# Altium project RadioDev.prjpcb
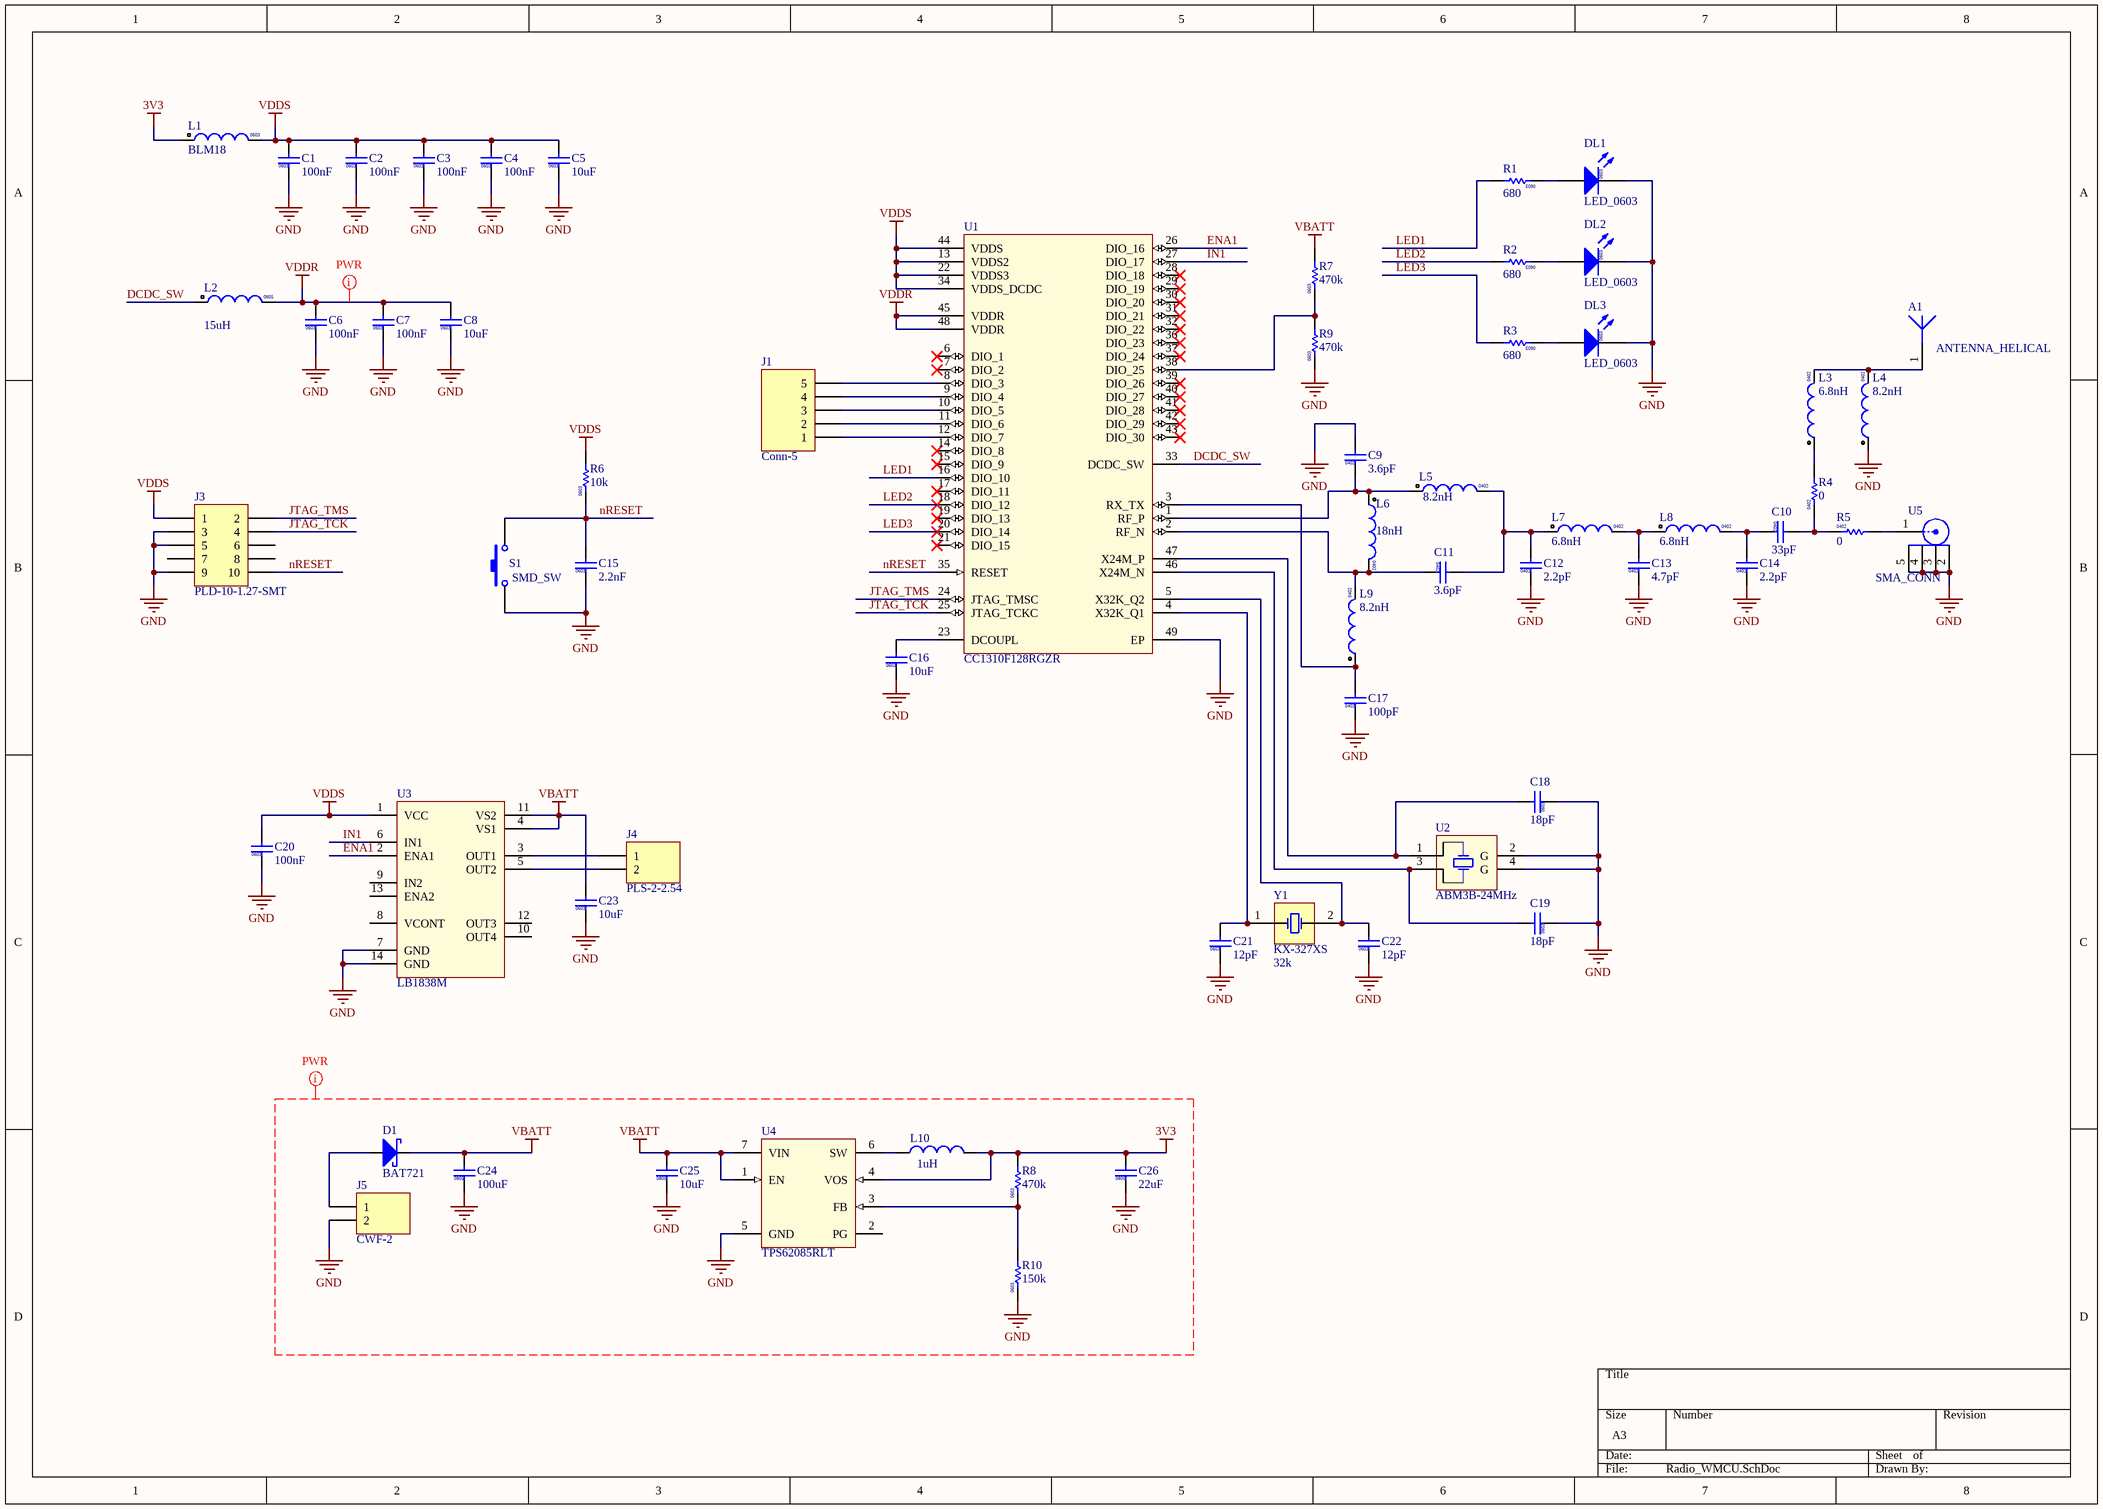
[diagram p0: Radio_WMCU.SchDoc]
1 sheet, 62 parts. Net scope: global (net labels, ports and power ports of the same name join across sheets).
Board file: Radio_WMCU.PcbDoc

## Sheet Radio_WMCU.SchDoc
size A3; PageSetup: Record=PageOptions|CenterHorizontal=True|CenterVertical=True|PrintScale=1.00|XCorrection=1.00|YCorrection=1.00|PrintKind=1|BorderSize=5000000|LeftOffset=0|BottomOffset=0|Orientation=1|PaperLength=1000|PaperWidth=1000|Scale=100|PaperSource=15|PrintQuality=600|MediaType=1|DitherType=10|PrintScaleMode=1|PaperKind=Letter|PaperIndex=1

### Parts
A1  ANTENNA_HELICAL  [ANTENNA]
C1  value 100nF  [CAPC1608-0603M]  (hidden comment: CAPC_0603)
C2  value 100nF  [CAPC1608-0603M]  (hidden comment: CAPC_0603)
C3  value 100nF  [CAPC1608-0603M]  (hidden comment: CAPC_0603)
C4  value 100nF  [CAPC1608-0603M]  (hidden comment: CAPC_0603)
C5  value 10uF  [CAPC1608-0603M]  (hidden comment: CAPC_0603)
C6  value 100nF  [CAPC1608-0603M]  (hidden comment: CAPC_0603)
C7  value 100nF  [CAPC1608-0603M]  (hidden comment: CAPC_0603)
C8  value 10uF  [CAPC1608-0603M]  (hidden comment: CAPC_0603)
C9  value 3.6pF  [CAPC1005-0402M]  (hidden comment: CAPC_0402)
C10  value 33pF  [CAPC1005-0402M]  (hidden comment: CAPC_0402)
C11  value 3.6pF  [CAPC1005-0402M]  (hidden comment: CAPC_0402)
C12  value 2.2pF  [CAPC1005-0402M]  (hidden comment: CAPC_0402)
C13  value 4.7pF  [CAPC1005-0402M]  (hidden comment: CAPC_0402)
C14  value 2.2pF  [CAPC1005-0402M]  (hidden comment: CAPC_0402)
C15  value 2.2nF  [CAPC1608-0603M]  (hidden comment: CAPC_0603)
C16  value 10uF  [CAPC1608-0603M]  (hidden comment: CAPC_0603)
C17  value 100pF  [CAPC1005-0402M]  (hidden comment: CAPC_0402)
C18  value 18pF  [CAPC1608-0603M]  (hidden comment: CAPC_0603)
C19  value 18pF  [CAPC1608-0603M]  (hidden comment: CAPC_0603)
C20  value 100nF  [CAPC1608-0603M]  (hidden comment: CAPC_0603)
C21  value 12pF  [CAPC1608-0603M]  (hidden comment: CAPC_0603)
C22  value 12pF  [CAPC1608-0603M]  (hidden comment: CAPC_0603)
C23  value 10uF  [CAPC1608-0603M]  (hidden comment: CAPC_0603)
C24  value 100uF  [CAPC2012-0805M]  (hidden comment: CAPC_0805)
C25  value 10uF  [CAPC2012-0805M]  (hidden comment: CAPC_0805)
C26  value 22uF  [CAPC2012-0805M]  (hidden comment: CAPC_0805)
D1  BAT721  [SOT23-3M]
DL1  LED_0603  [DIODEC1608-0603]
DL2  LED_0603  [DIODEC1608-0603]
DL3  LED_0603  [DIODEC1608-0603]
J1  Conn-5  [CONN-5-2.54]
J3  PLD-10-1.27-SMT  [PLD-10-1.27-SMT]
J4  PLS-2-2.54  [PLS-2-2.54]
J5  CWF-2  [CWF-2]
L1  value BLM18  [INDC1608M]  (hidden comment: INDC-0603)
L2  value 15uH  [INDC2012M]  (hidden comment: INDC-0805)
L3  value 6.8nH  [INDC1005-0402-RF2.4GHz]  (hidden comment: INDC-0402)
L4  value 8.2nH  [INDC1005-0402-RF2.4GHz]  (hidden comment: INDC-0402)
L5  value 8.2nH  [INDC1005-0402-RF2.4GHz]  (hidden comment: INDC-0402)
L6  value 18nH  [INDC1005-0402-RF2.4GHz]  (hidden comment: INDC-0402)
L7  value 6.8nH  [INDC1005-0402-RF2.4GHz]  (hidden comment: INDC-0402)
L8  value 6.8nH  [INDC1005-0402-RF2.4GHz]  (hidden comment: INDC-0402)
L9  value 8.2nH  [INDC1005-0402-RF2.4GHz]  (hidden comment: INDC-0402)
L10  value 1uH  [XFL4015]  (hidden comment: XFL4015)
R1  value 680  [RESC1608-0603M]  (hidden comment: RESC_0603)
R2  value 680  [RESC1608-0603M]  (hidden comment: RESC_0603)
R3  value 680  [RESC1608-0603M]  (hidden comment: RESC_0603)
R4  value 0  [RESC1005-0402M]  (hidden comment: RESC_0402)
R5  value 0  [RESC1005-0402M]  (hidden comment: RESC_0402)
R6  value 10k  [RESC1608-0603M]  (hidden comment: RESC_0603)
R7  value 470k  [RESC1608-0603M]  (hidden comment: RESC_0603)
R8  value 470k  [RESC1608-0603M]  (hidden comment: RESC_0603)
R9  value 470k  [RESC1608-0603M]  (hidden comment: RESC_0603)
R10  value 150k  [RESC1608-0603M]  (hidden comment: RESC_0603)
S1  SMD_SW  [SMD_SW_1]
U1  CC1310F128RGZR  [QFN-48M]
U2  ABM3B-24MHz  [ABM3B-24MHz]
U3  LB1838M  [MFP14S_M]
U4  TPS62085RLT  [RLT7-0506]
U5  SMA_CONN  [SMA_CONN]
Y1  KX-327XS  value 32k  [KX-327xs]

### Nets
3V3: C26.2 L1.1 L10.2 R8.2 U4.4(VOS)
GND: C1.1 C2.1 C3.1 C4.1 C5.1 C6.1 C7.1 C8.1 C9.2 C12.1 C13.1 C14.1 C15.1 C16.1 C17.1 C18.1 C19.1 C20.1 C21.1 C22.1 C23.1 C24.1 C25.1 C26.1 DL1.2(K) DL2.2(K) DL3.2(K) J3.3 J3.5 J3.9 J5.2 L4.1 R9.1 R10.1 S1.1 U1.49(EP) U2.2(G) U2.4(G) U3.7(GND) U3.14(GND) U4.5(GND) U5.2 U5.3 U5.4 U5.5
VBATT: C23.2 C24.2 C25.2 D1.3(K) R7.2 U3.4(VS1) U3.11(VS2) U4.1(EN) U4.7(VIN)
VDDR: C6.2 C7.2 C8.2 L2.2 U1.45(VDDR) U1.48(VDDR)
VDDS: C1.2 C2.2 C3.2 C4.2 C5.2 C20.2 J3.1 L1.2 R6.2 U1.13(VDDS2) U1.22(VDDS3) U1.34(VDDS_DCDC) U1.44(VDDS) U3.1(VCC)
DCDC_SW: L2.1 U1.33(DCDC_SW)
ENA1: U1.26(DIO_16) U3.2(ENA1)
IN1: U1.27(DIO_17) U3.6(IN1)
JTAG_TCK: J3.4 U1.25(JTAG_TCKC)
JTAG_TMS: J3.2 U1.24(JTAG_TMSC)
LED1: R1.2 U1.16(DIO_10)
LED2: R2.2 U1.18(DIO_12)
LED3: R3.2 U1.20(DIO_14)
nRESET: C15.2 J3.10 R6.1 S1.2 U1.35(RESET)
NetA1_1: A1.1 L3.2 L4.2
NetC9_1: C9.1 L5.1 L6.1 U1.1(RF_P)
NetC10_1: C10.1 C14.2 L8.2
NetC10_2: C10.2 R4.1 R5.1
NetC11_1: C11.1 L6.2 L9.2 U1.2(RF_N)
NetC11_2: C11.2 C12.2 L5.2 L7.1
NetC13_2: C13.2 L7.2 L8.1
NetC16_2: C16.2 U1.23(DCOUPL)
NetC17_2: C17.2 L9.1 U1.3(RX_TX)
NetC18_2: C18.2 U1.47(X24M_P) U2.1
NetC19_2: C19.2 U1.46(X24M_N) U2.3
NetC21_2: C21.2 U1.4(X32K_Q1) Y1.1
NetC22_2: C22.2 U1.5(X32K_Q2) Y1.2
NetD1_1: D1.1(A) J5.1
NetDL1_1: DL1.1(A) R1.1
NetDL2_1: DL2.1(A) R2.1
NetDL3_1: DL3.1(A) R3.1
NetJ1_1: J1.1 U1.12(DIO_7)
NetJ1_2: J1.2 U1.11(DIO_6)
NetJ1_3: J1.3 U1.10(DIO_5)
NetJ1_4: J1.4 U1.9(DIO_4)
NetJ1_5: J1.5 U1.8(DIO_3)
NetJ4_1: J4.1 U3.3(OUT1)
NetJ4_2: J4.2 U3.5(OUT2)
NetL3_1: L3.1 R4.2
NetL10_1: L10.1 U4.6(SW)
NetR5_2: R5.2 U5.1
NetR7_1: R7.1 R9.2 U1.38(DIO_25)
NetR8_1: R8.1 R10.2 U4.3(FB)

Not connected (* = marked no-connect by the designer): J3 6 7 8; U1 6(DIO_1)* 7(DIO_2)* 14(DIO_8)* 15(DIO_9)* 17(DIO_11)* 19(DIO_13)* 21(DIO_15)* 28(DIO_18)* 29(DIO_19)* 30(DIO_20)* 31(DIO_21)* 32(DIO_22)* 36(DIO_23)* 37(DIO_24)* 39(DIO_26)* 40(DIO_27)* 41(DIO_28)* 42(DIO_29)* 43(DIO_30)*; U3 8(VCONT) 9(IN2) 10(OUT4) 12(OUT3) 13(ENA2); U4 2(PG)

### Layout directives
net class PWR: 3V3, GND, VBATT, VDDR

### Notes on the sheet
- (in symbol CAPC_0402) 0402
- (in symbol CAPC_0603) 0603
- (in symbol CAPC_0805) 0805
- (in symbol INDC-0603) 0603
- (in symbol INDC-0805) 0805
- (in symbol LED_0603) 0603
- (in symbol RESC_0402) 0402
- (in symbol RESC_0603) 0603

### Library data of the parts
A1 = ANTENNA_HELICAL: PCB helical antenna
C1-C8 C15 C16 C18-C23 = CAPC_0603: Capacitor 0603
C9-C14 C17 = CAPC_0402: Capacitor 0402
C24-C26 = CAPC_0805: Capacitor 0805
D1 = BAT721: BAT721 Schottky diode(s)
DL1-DL3 = LED_0603: LED 0603; Part number: *BL-...; Color: Red
J1 = Conn-5: Header, 6-Pin, Dual row; LatestRevisionDate: 17-Jul-2002; LatestRevisionNote: Re-released for DXP Platform.; Publisher: Altium Limited
L1 = INDC-0603: Chip Inductor, Body Body 1.6x0.8mm
L2 = INDC-0805: Chip Inductor, Body Body 2.0x1.2mm
L3-L9 = INDC-0402: Chip Inductor, Body 1.0x0.5mm; Code_IEC: 1005; Published: 8-Jun-2000; LatestRevisionDate: 17-Jul-2002; LatestRevisionNote: Re-released for DXP Platform.; PackageReference: 0402-A; Publisher: Altium Limited; Code_JEITA: 0402
L10 = XFL4015: Power Inductors
R1-R3 R6-R10 = RESC_0603: Resistor 0603
R4 R5 = RESC_0402: Resistor 0402
S1 = SMD_SW: Switch; Published: 24-Mar-1999; LatestRevisionDate: 17-Jul-2002; LatestRevisionNote: Re-released for DXP Platform.; PackageReference: SPST-2; Publisher: Altium Limited
U1 = CC1310F128RGZR: Ultralow Power Sub-1-GHz Wireless MCU
U2 = ABM3B-24MHz: Crystal Oscillator, 24 MHz, SMD, 5mm x 3.2mm
U3 = LB1838M: Low-Voltage, Bidiractional Motor Driver
U4 = TPS62085RLT: Step-Down Converter With Hiccup Short-Circuit Protection, 2.5-V to 6.0-V input Voltage Range
U5 = SMA_CONN: SMA Straight PCB Socket
Y1 = KX-327XS: Surface Mount Quartz Crystal
J3 = PLD-10-1.27-SMT: LatestRevisionDate: 17-Jul-2002; LatestRevisionNote: Re-released for DXP Platform.; Publisher: Altium Limited
J4 = PLS-2-2.54: LatestRevisionDate: 17-Jul-2002; LatestRevisionNote: Re-released for DXP Platform.; Publisher: Altium Limited